# EAGLE design pcb (EAGLE 9.6.2)

## Sheet 1 of 4: Microcontrolador
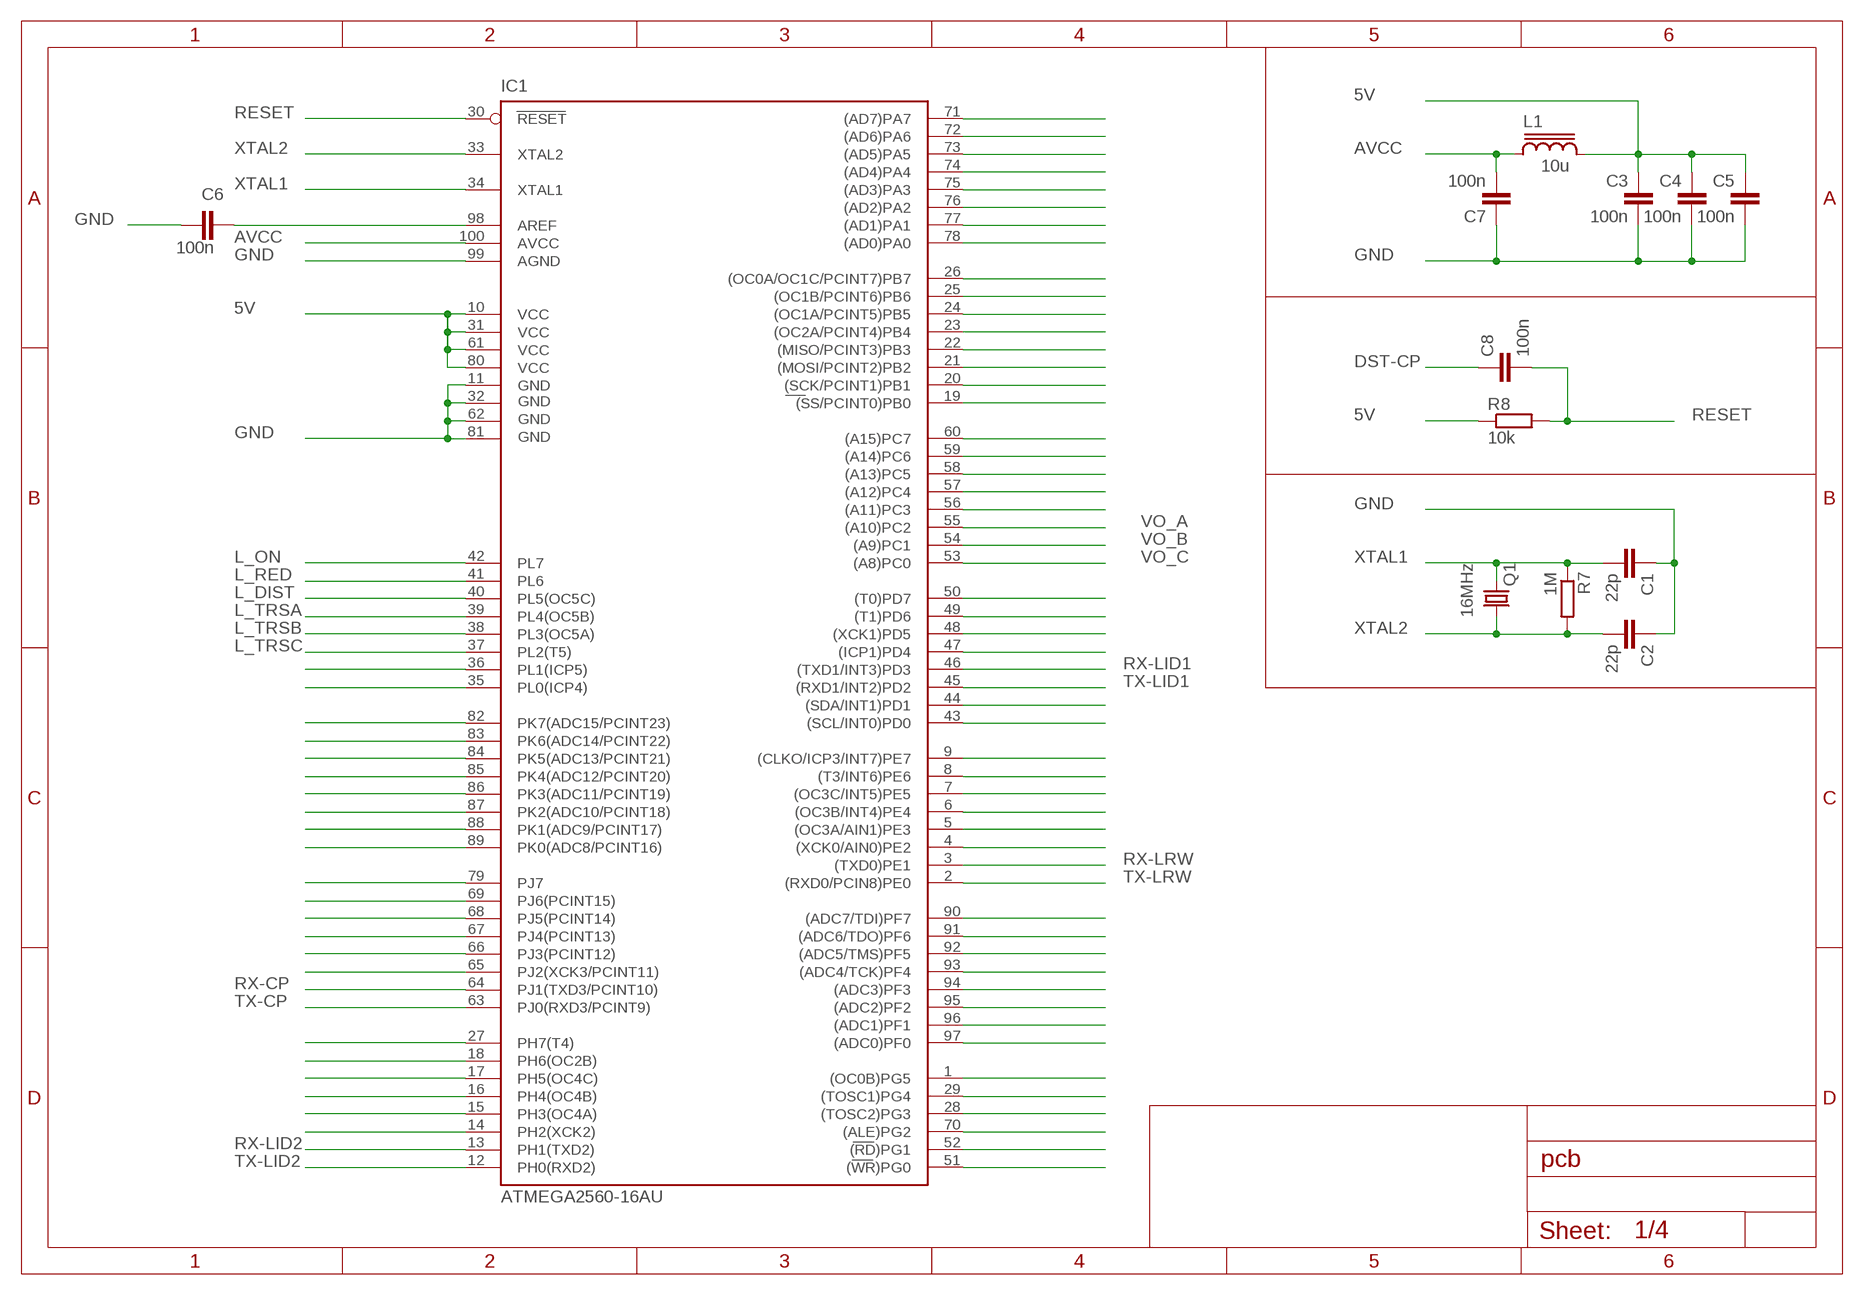
[diagram p0: schematic, sheet 1]

### Parts
C1  22p  C-EU050-025X075  [C050-025X075]
C2  22p  C-EU050-025X075  [C050-025X075]
C3  100n  C-EU050-025X075  [C050-025X075]
C4  100n  C-EU050-025X075  [C050-025X075]
C5  100n  C-EU050-025X075  [C050-025X075]
C6  100n  C-EU050-025X075  [C050-025X075]
C7  100n  C-EU050-025X075  [C050-025X075]
C8  100n  C-EU050-025X075  [C050-025X075]
IC1  ATMEGA2560-16AU  [TQFP100]
L1  10u  MSS1260  [MSS1260]
Q1  16MHz  CRYSTALHC18U-V  [HC18U-V]
R7  1M  R-EU_R1206W  [R1206W]
R8  10k  R-EU_R1206W  [R1206W]

### Nets
5V: C3.2 C4.2 C5.2 IC1.10(VCC) IC1.31(VCC1) IC1.61(VCC2) IC1.80(VCC3) L1.2 R8.1 ; also sheet 2,4
AVCC: C7.2 IC1.100(AVCC) L1.1
DST-CP: C8.1 ; also sheet 4
GND: C1.1 C2.1 C3.1 C4.1 C5.1 C6.2 C7.1 IC1.11(GND) IC1.32(GND1) IC1.62(GND2) IC1.81(GND3) IC1.99(AGND) ; also sheet 2,3,4
L_DIST: IC1.40(PL5(OC5C)) ; also sheet 4
L_ON: IC1.42(PL7)
L_RED: IC1.41(PL6) ; also sheet 4
L_TRSA: IC1.39(PL4(OC5B)) ; also sheet 4
L_TRSB: IC1.38(PL3(OC5A)) ; also sheet 4
L_TRSC: IC1.37(PL2(T5)) ; also sheet 4
N$22: C6.1 IC1.98(AREF)
N$46: IC1.36(PL1(ICP5))
N$47: IC1.82(PK7(ADC15/PCINT23))
N$48: IC1.84(PK5(ADC13/PCINT21))
N$49: IC1.86(PK3(ADC11/PCINT19))
N$50: IC1.88(PK1(ADC9/PCINT17))
N$52: IC1.79(PJ7)
N$53: IC1.68(PJ5(PCINT14))
N$54: IC1.66(PJ3(PCINT12))
N$56: IC1.27(PH7(T4))
N$57: IC1.17(PH5(OC4C))
N$58: IC1.15(PH3(OC4A))
N$60: IC1.71((AD7)PA7)
N$62: IC1.73((AD5)PA5)
N$63: IC1.75((AD3)PA3)
N$64: IC1.77((AD1)PA1)
N$66: IC1.26((OC0A/OC1C/PCINT7)PB7)
N$69: IC1.24((OC1A/PCINT5)PB5)
N$80: IC1.35(PL0(ICP4))
N$81: IC1.83(PK6(ADC14/PCINT22))
N$82: IC1.22((MISO/PCINT3)PB3)
N$83: IC1.19((SS/PCINT0)PB0)
N$84: IC1.60((A15)PC7)
N$85: IC1.58((A13)PC5)
N$86: IC1.56((A11)PC3)
N$87: IC1.85(PK4(ADC12/PCINT20))
N$88: IC1.87(PK2(ADC10/PCINT18))
N$89: IC1.89(PK0(ADC8/PCINT16))
N$90: IC1.69(PJ6(PCINT15))
N$91: IC1.67(PJ4(PCINT13))
N$92: IC1.65(PJ2(XCK3/PCINT11))
N$94: IC1.18(PH6(OC2B))
N$95: IC1.16(PH4(OC4B))
N$96: IC1.14(PH2(XCK2))
N$98: IC1.72((AD6)PA6)
N$99: IC1.74((AD4)PA4)
N$100: IC1.76((AD2)PA2)
N$101: IC1.78((AD0)PA0)
N$102: IC1.25((OC1B/PCINT6)PB6)
N$103: IC1.23((OC2A/PCINT4)PB4)
N$104: IC1.21((MOSI/PCINT2)PB2)
N$105: IC1.20((SCK/PCINT1)PB1)
N$106: IC1.59((A14)PC6)
N$107: IC1.57((A12)PC4)
N$110: IC1.49((T1)PD6)
N$111: IC1.47((ICP1)PD4)
N$113: IC1.43((SCL/INT0)PD0)
N$114: IC1.8((T3/INT6)PE6)
N$115: IC1.6((OC3B/INT4)PE4)
N$116: IC1.4((XCK0/AIN0)PE2)
N$118: IC1.91((ADC6/TDO)PF6)
N$119: IC1.93((ADC4/TCK)PF4)
N$120: IC1.95((ADC2)PF2)
N$121: IC1.97((ADC0)PF0)
N$122: IC1.29((TOSC1)PG4)
N$123: IC1.70((ALE)PG2)
N$124: IC1.51((WR)PG0)
N$126: IC1.50((T0)PD7)
N$127: IC1.48((XCK1)PD5)
N$129: IC1.44((SDA/INT1)PD1)
N$130: IC1.9((CLKO/ICP3/INT7)PE7)
N$131: IC1.7((OC3C/INT5)PE5)
N$132: IC1.5((OC3A/AIN1)PE3)
N$134: IC1.90((ADC7/TDI)PF7)
N$135: IC1.92((ADC5/TMS)PF5)
N$136: IC1.94((ADC3)PF3)
N$137: IC1.96((ADC1)PF1)
N$138: IC1.1((OC0B)PG5)
N$139: IC1.28((TOSC2)PG3)
N$140: IC1.52((RD)PG1)
RESET: C8.2 IC1.30(RESET) R8.2
RX-CP: IC1.64(PJ1(TXD3/PCINT10)) ; also sheet 4
RX-LID1: IC1.46((TXD1/INT3)PD3) ; also sheet 4
RX-LID2: IC1.13(PH1(TXD2)) ; also sheet 4
RX-LRW: IC1.3((TXD0)PE1) ; also sheet 3
TX-CP: IC1.63(PJ0(RXD3/PCINT9)) ; also sheet 4
TX-LID1: IC1.45((RXD1/INT2)PD2) ; also sheet 4
TX-LID2: IC1.12(PH0(RXD2)) ; also sheet 4
TX-LRW: IC1.2((RXD0/PCIN8)PE0) ; also sheet 3
VO_A: IC1.55((A10)PC2) ; also sheet 4
VO_B: IC1.54((A9)PC1) ; also sheet 4
VO_C: IC1.53((A8)PC0) ; also sheet 4
XTAL1: C1.2 IC1.34(XTAL1) Q1.1 R7.1
XTAL2: C2.2 IC1.33(XTAL2) Q1.2 R7.2

## Sheet 2 of 4: Alimentación y voltajes de la placa
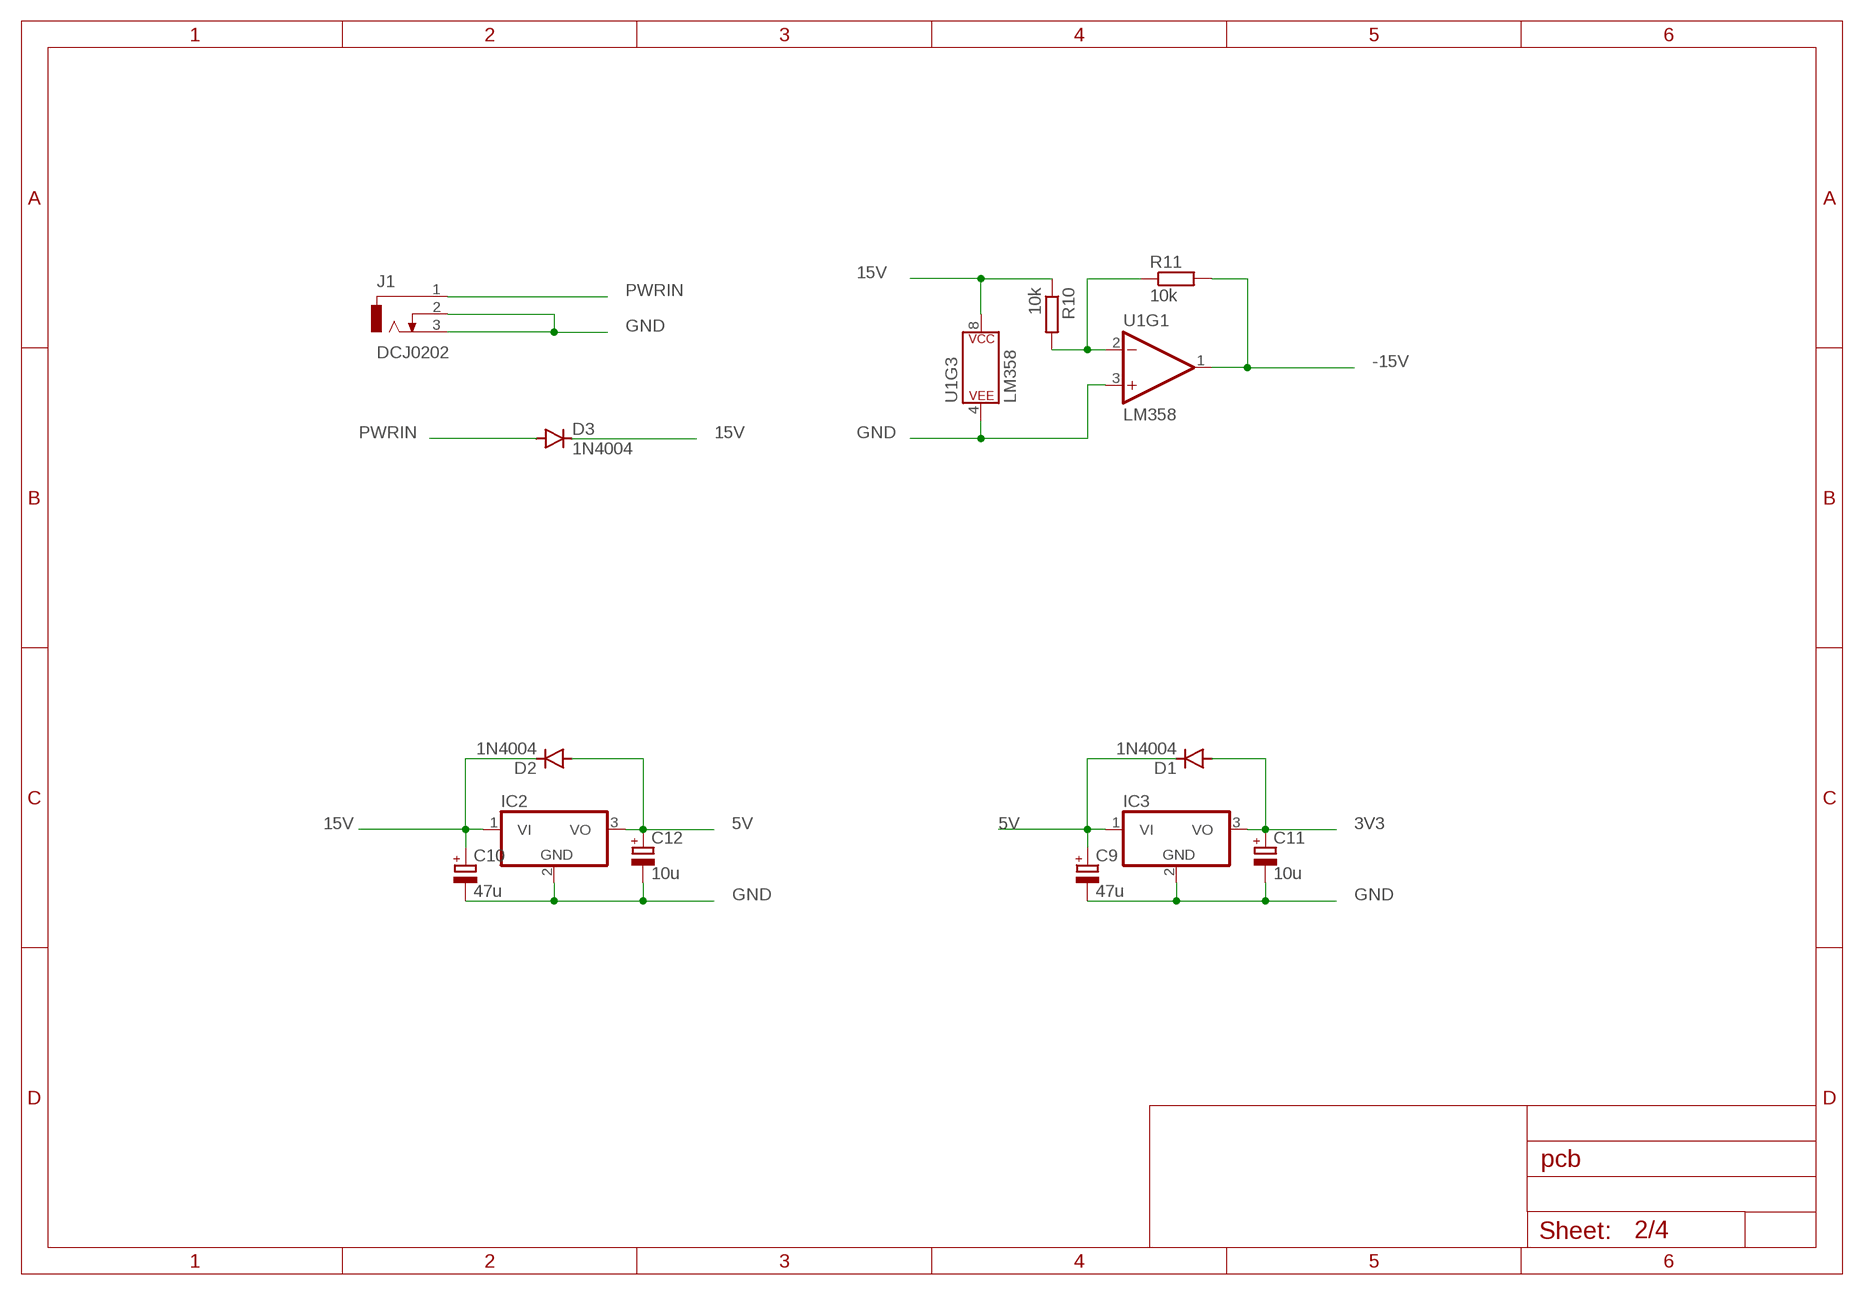
[diagram p1: schematic, sheet 2]

### Parts
C9  47u  CPOL-EUE2,5-6E  [E2,5-6E]
C10  47u  CPOL-EUE2,5-6E  [E2,5-6E]
C11  10u  CPOL-EUE2,5-6E  [E2,5-6E]
C12  10u  CPOL-EUE2,5-6E  [E2,5-6E]
D1  1N4004  [DO41-10]
D2  1N4004  [DO41-10]
D3  1N4004  [DO41-10]
IC2  7805T  [TO220H]
IC3  7805T  [TO220H]
J1  DCJ0202  [DCJ0202]
R10  10k  R-EU_R1206W  [R1206W]
R11  10k  R-EU_R1206W  [R1206W]
U1  LM358  [DIP08]

### Nets
3V3: C11.+ D1.A IC3.3(VO) ; also sheet 3,4
5V: C9.+ C12.+ D1.C D2.A IC2.3(VO) IC3.1(VI) ; also sheet 1,4
15V: C10.+ D2.C D3.C IC2.1(VI) R10.1 U1.8(P$V+) ; also sheet 4
-15V: R11.2 U1.1(OUT) ; also sheet 4
GND: C9.- C10.- C11.- C12.- IC2.2(GND) IC3.2(GND) J1.2 J1.3 U1.3(+IN) U1.4(P$V-) ; also sheet 1,3,4
N$15: R10.2 R11.1 U1.2(-IN)
PWRIN: D3.A J1.1
Unconnected: U1.5(+IN) U1.6(-IN) U1.7(OUT)

## Sheet 3 of 4: Modulo LoraWAN
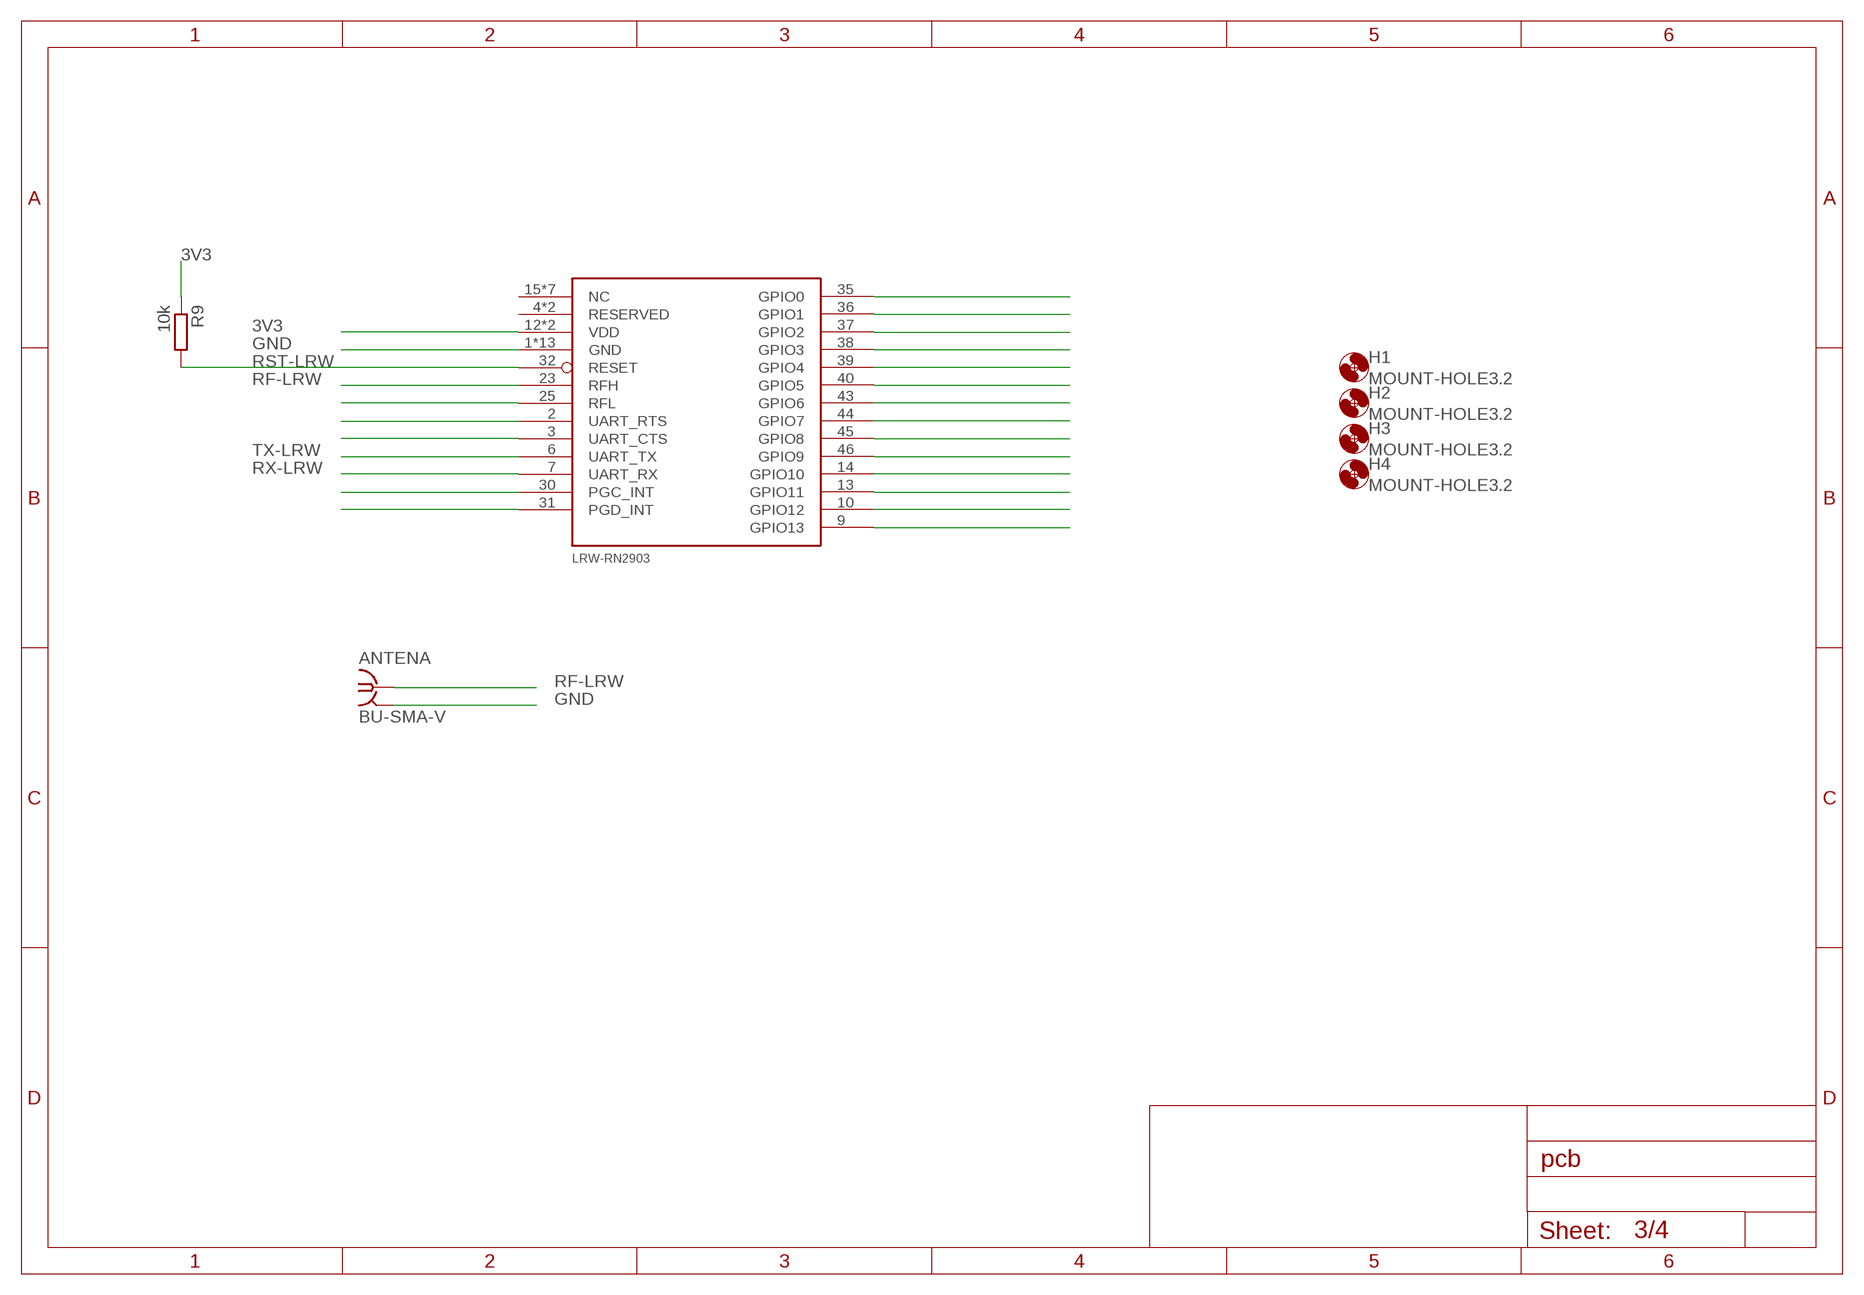
[diagram p2: schematic, sheet 3]

### Parts
ANTENA  BU-SMA-V  [BU-SMA-V]
H1  MOUNT-HOLE3.2  [3,2]
H2  MOUNT-HOLE3.2  [3,2]
H3  MOUNT-HOLE3.2  [3,2]
H4  MOUNT-HOLE3.2  [3,2]
LRW-RN2903  MICROCHIP_RN2483  [MICROCHIP_RN2483]
R9  10k  R-EU_R1206W  [R1206W]

### Nets
3V3: LRW-RN2903.12(VDD) LRW-RN2903.34(VDD) R9.1 ; also sheet 2,4
GND: ANTENA.2 ANTENA.3 ANTENA.4 ANTENA.5 LRW-RN2903.1(GND) LRW-RN2903.8(GND) LRW-RN2903.11(GND) LRW-RN2903.20(GND) LRW-RN2903.21(GND) LRW-RN2903.22(GND) LRW-RN2903.24(GND) LRW-RN2903.26(GND) LRW-RN2903.27(GND) LRW-RN2903.28(GND) LRW-RN2903.33(GND) LRW-RN2903.41(GND) LRW-RN2903.47(GND) ; also sheet 1,2,4
N$1: LRW-RN2903.35(GPIO0)
N$2: LRW-RN2903.36(GPIO1)
N$3: LRW-RN2903.37(GPIO2)
N$4: LRW-RN2903.38(GPIO3)
N$5: LRW-RN2903.40(GPIO5)
N$6: LRW-RN2903.44(GPIO7)
N$7: LRW-RN2903.14(GPIO10)
N$8: LRW-RN2903.13(GPIO11)
N$9: LRW-RN2903.9(GPIO13)
N$10: LRW-RN2903.39(GPIO4)
N$11: LRW-RN2903.43(GPIO6)
N$12: LRW-RN2903.45(GPIO8)
N$13: LRW-RN2903.46(GPIO9)
N$14: LRW-RN2903.10(GPIO12)
N$17: LRW-RN2903.25(RFL)
N$18: LRW-RN2903.3(UART_CTS)
N$20: LRW-RN2903.31(PGD_INT)
N$23: LRW-RN2903.2(UART_RTS)
N$25: LRW-RN2903.30(PGC_INT)
RF-LRW: ANTENA.1 LRW-RN2903.23(RFH)
RST-LRW: LRW-RN2903.32(RESET) R9.2
RX-LRW: LRW-RN2903.7(UART_RX) ; also sheet 1
TX-LRW: LRW-RN2903.6(UART_TX) ; also sheet 1
Unconnected: LRW-RN2903.4(RESERVED) LRW-RN2903.5(RESERVED) LRW-RN2903.15(NC) LRW-RN2903.16(NC) LRW-RN2903.17(NC) LRW-RN2903.18(NC) LRW-RN2903.19(NC) LRW-RN2903.29(NC) LRW-RN2903.42(NC)

## Sheet 4 of 4: Perifericos: sensores, leds y conversor
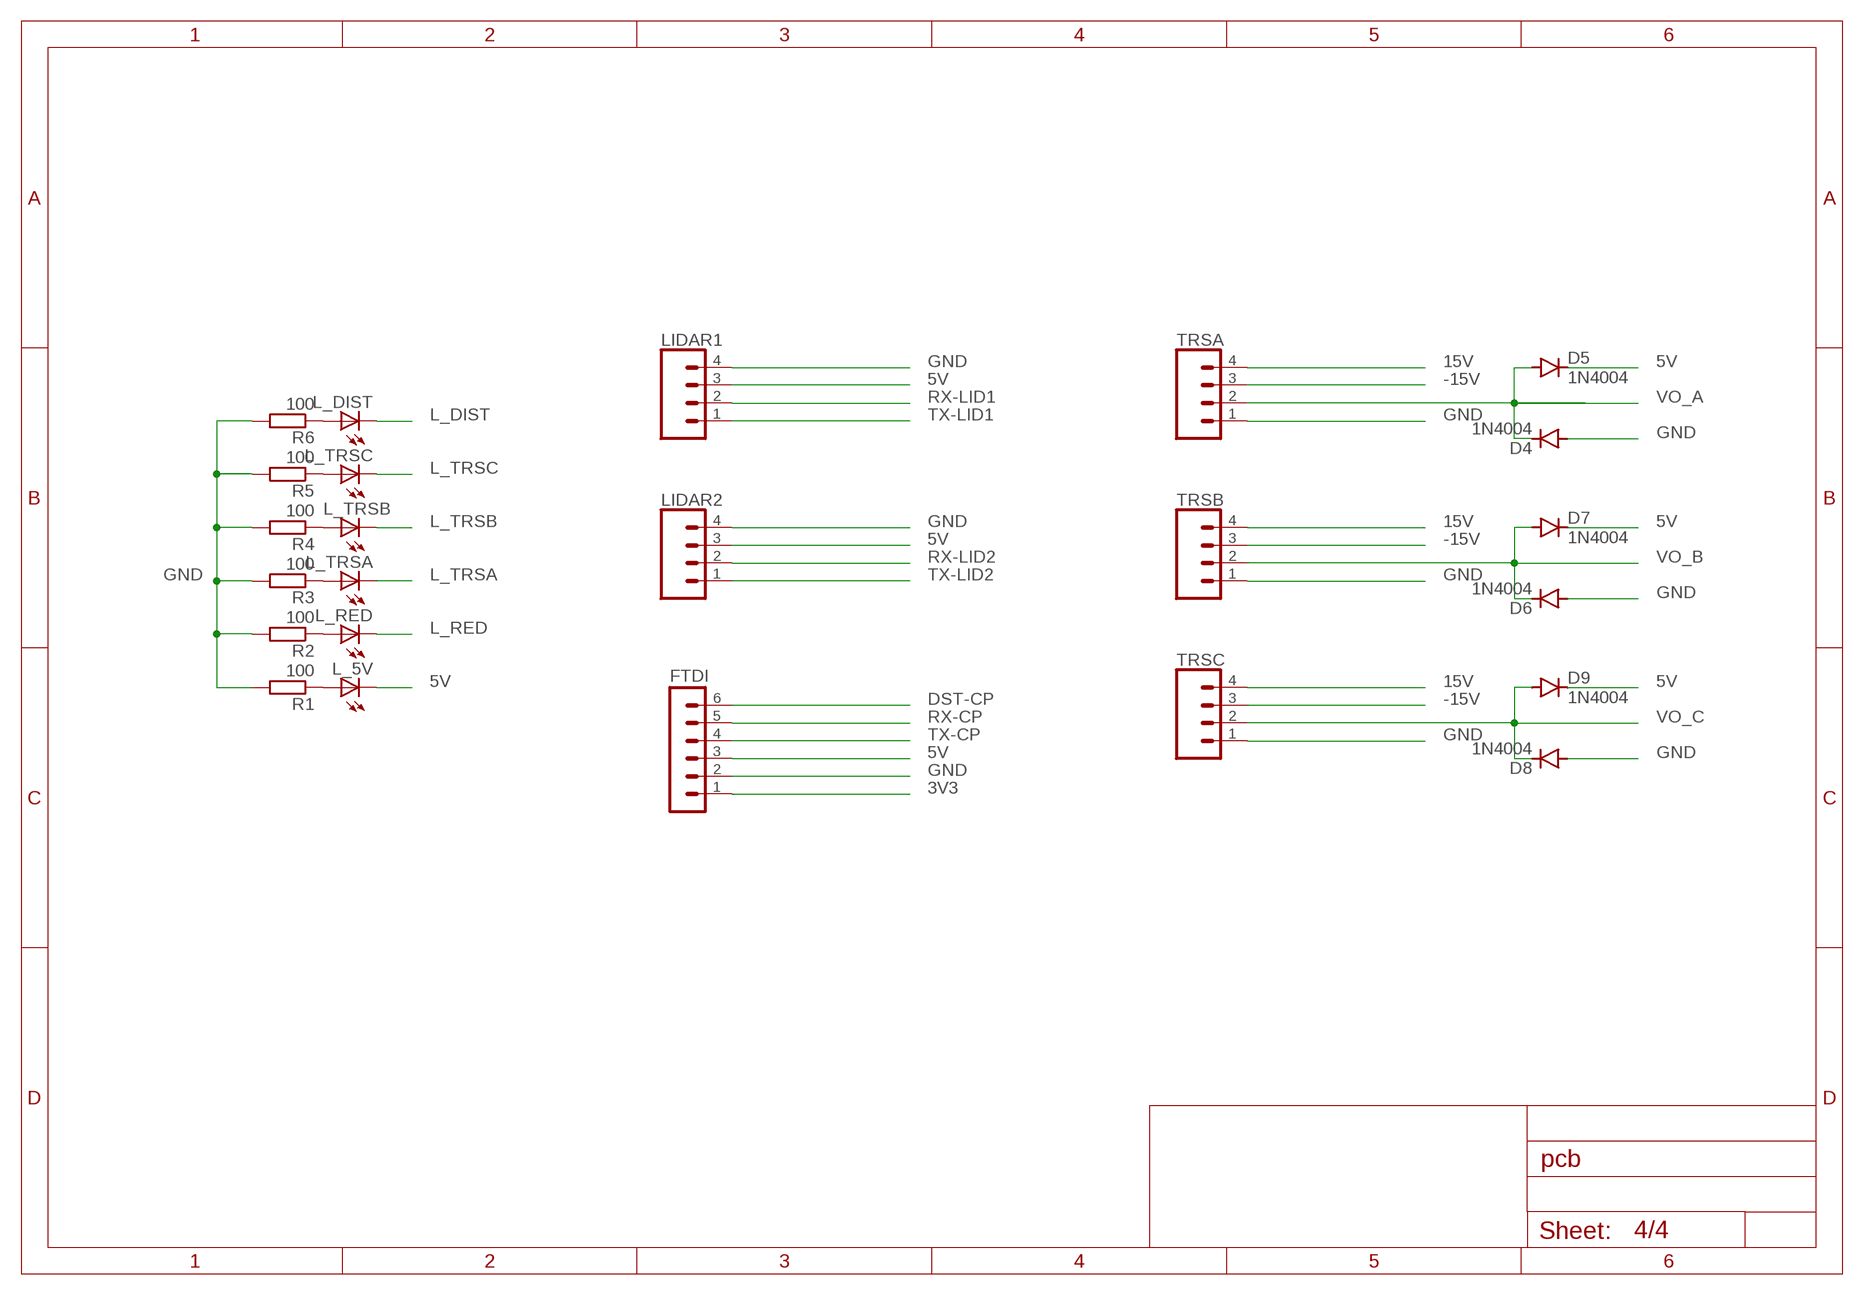
[diagram p3: schematic, sheet 4]

### Parts
D4  1N4004  [DO41-10]
D5  1N4004  [DO41-10]
D6  1N4004  [DO41-10]
D7  1N4004  [DO41-10]
D8  1N4004  [DO41-10]
D9  1N4004  [DO41-10]
FTDI  MA06-1  [MA06-1]
L_5V  LED5MM  [LED5MM]
L_DIST  LED5MM  [LED5MM]
L_RED  LED5MM  [LED5MM]
L_TRSA  LED5MM  [LED5MM]
L_TRSB  LED5MM  [LED5MM]
L_TRSC  LED5MM  [LED5MM]
LIDAR1  CONN_04JST-PTH  [JST-4-PTH]
LIDAR2  CONN_04JST-PTH  [JST-4-PTH]
R1  100  R-EU_R1206W  [R1206W]
R2  100  R-EU_R1206W  [R1206W]
R3  100  R-EU_R1206W  [R1206W]
R4  100  R-EU_R1206W  [R1206W]
R5  100  R-EU_R1206W  [R1206W]
R6  100  R-EU_R1206W  [R1206W]
TRSA  CONN_04JST-PTH  [JST-4-PTH]
TRSB  CONN_04JST-PTH  [JST-4-PTH]
TRSC  CONN_04JST-PTH  [JST-4-PTH]

### Nets
3V3: FTDI.1 ; also sheet 2,3
5V: D5.C D7.C D9.C FTDI.3 L_5V.K(C) LIDAR1.3 LIDAR2.3 ; also sheet 1,2
15V: TRSA.4 TRSB.4 TRSC.4 ; also sheet 2
-15V: TRSA.3 TRSB.3 TRSC.3 ; also sheet 2
DST-CP: FTDI.6 ; also sheet 1
GND: D4.A D6.A D8.A FTDI.2 LIDAR1.4 LIDAR2.4 R1.2 R2.2 R3.2 R4.2 R5.2 R6.2 TRSA.1 TRSB.1 TRSC.1 ; also sheet 1,2,3
L_DIST: L_DIST.K(C) ; also sheet 1
L_RED: L_RED.K(C) ; also sheet 1
L_TRSA: L_TRSA.K(C) ; also sheet 1
L_TRSB: L_TRSB.K(C) ; also sheet 1
L_TRSC: L_TRSC.K(C) ; also sheet 1
N$16: L_TRSB.A R4.1
N$32: L_5V.A R1.1
N$33: L_RED.A R2.1
N$34: L_TRSA.A R3.1
N$36: L_TRSC.A R5.1
N$37: L_DIST.A R6.1
RX-CP: FTDI.5 ; also sheet 1
RX-LID1: LIDAR1.2 ; also sheet 1
RX-LID2: LIDAR2.2 ; also sheet 1
TX-CP: FTDI.4 ; also sheet 1
TX-LID1: LIDAR1.1 ; also sheet 1
TX-LID2: LIDAR2.1 ; also sheet 1
VO_A: D4.C D5.A TRSA.2 ; also sheet 1
VO_B: D6.C D7.A TRSB.2 ; also sheet 1
VO_C: D8.C D9.A TRSC.2 ; also sheet 1

## Library data of the parts
ANTENA = con-coax:BU-SMA-V: FEMALE SMA CONNECTOR Radiall distributor RS 112-3794; OC_FARNELL: unknown; OC_NEWARK: unknown
C1-C8 = rcl:C-EU: CAPACITOR, European symbol; SPICEPREFIX: C
C9-C12 = rcl:CPOL-EU: POLARIZED CAPACITOR, European symbol; SPICEPREFIX: C
D1-D9 = diode:1N4004: DIODE general purpose rectifier, 1 A
FTDI = con-lstb:MA06-1: PIN HEADER; OC_FARNELL: unknown; OC_NEWARK: unknown
H1-H4 = holes:MOUNT-HOLE: MOUNTING HOLE with drill center marker
IC1 = atmel-2005:ATMEGA*: MICROCONTROLLER 64/128/256 Kbytes FLASH 4 Kbytes EEPROM 8 Kbytes SRAM 86 General Purpose I/O pins 12-channels16-bit PWM 4 x Serial USARTs 16-channels 10-bit A/D
IC2 = linear:78*: Positive VOLTAGE REGULATOR Source: http://cache.national.com/ds/LM/LM78L05.pdf http://www.fairchildsemi.com/ds/LM/LM7805.pdf; VOUT: 5V
IC3 = linear:78*: Positive VOLTAGE REGULATOR Source: http://cache.national.com/ds/LM/LM78L05.pdf http://www.fairchildsemi.com/ds/LM/LM7805.pdf
J1 = con-jack:DCJ0202: DC POWER JACK Source: DCJ0202.pdf; OC_FARNELL: unknown; OC_NEWARK: unknown
L1 = inductor-coilcraft2:MSS1260: SMT Power Inductor
L_5V L_DIST L_RED L_TRSA L_TRSB L_TRSC = adafruit:LED: LED OSRAM: - CHIPLED LG R971, LG N971, LY N971, LG Q971, LY Q971, LO R971, LY R971 LH N974, LH R974 LS Q976, LO Q976, LY Q976 LO Q996 - Hyper CHIPLED LW Q18S LB Q993, LB Q99A, LB R99A - SideLED LS A670, LO A670, LY A670, LG A670, LP A670 LB A673, LV A673, LT A673, LW A673 LH A674 LY A675 LS A676, LA A676, LO A676, LY A676, LW A676 LS A679, LY A679, LG A679 - Hyper Micro SIDELED® LS Y876, LA Y876, LO Y876, LY Y876 LT Y87S - SmartLED LW L88C, LW L88S LB L89C, LB L89S, LG L890 LS L89K, LO L89K, LY L89K LS L896, LA L896, LO L896, LY L896 - TOPLED LS T670, LO T670, LY T670, LG T670, LP T670 LSG T670, LSP T670, LSY T670, LOP T670, LYG T670 LG T671, LOG T671, LSG T671 LB T673, LV T673, LT T673, LW T673 LH T674 LS T676, LA T676, LO T676, LY T676, LB T676, LH T676, LSB T676, LW T676 LB T67C, LV T67C, LT T67C, LS T67K, LO T67K, LY T67K, LW E67C LS E67B, LA E67B, LO E67B, LY E67B, LB E67C, LV E67C, LT E67C LW T67C LS T679, LY T679, LG T679 LS T770, LO T770, LY T770, LG T770, LP T770 LB T773, LV T773, LT T773, LW T773 LH T774 LS E675, LA E675, LY E675, LS T675 LS T776, LA T776, LO T776, LY T776, LB T776 LHGB T686 LT T68C, LB T68C - Hyper Mini TOPLED® LB M676 - Mini TOPLED Santana® LG M470 LS M47K, LO M47K, LY M47K Source: http://www.osram.convergy.de/
LIDAR1 LIDAR2 TRSA TRSB TRSC = sparkfun-connectors:CONN_04: Multi connection point. Often used as Generic Header-pin footprint for 0.1 inch spaced/style header connections On any of the 0.1 inch spaced packages, you can populate with these: Break Away Headers - Straight <https://www.sparkfun.com/products/116> (PRT-00116) Break Away Male Headers - Right Angle <https://www.sparkfun.com/products/553> (PRT-00553) Female Headers <https://www.sparkfun.com/products/115> (PRT-00115) Break Away Headers - Machine Pin <https://www.sparkfun.com/products/117> (PRT-00117) Break Away Female Headers - Swiss Machine Pin <https://www.sparkfun.com/products/743> (PRT-00743) For SCREWTERMINALS and SPRING TERMINALS visit here: Screw Terimnals on SparkFun.com <https://www.sparkfun.com/search/results?term=Screw+Terminals> (5mm/3.5mm/2.54mm spacing) This device is also useful as a general connection point to wire up your design to another part of your project. Our various solder wires solder well into these plated through hole pads. Hook-Up Wire - Assortment (Stranded, 22 AWG) <https://www.sparkfun.com/products/11375> (PRT-11375) Hook-Up Wire - Assortment (Solid Core, 22 AWG) <https://www.sparkfun.com/products/11367> (PRT-11367) View the entire wire category on our website here <https://www.sparkfun.com/categories/141> Special notes: Molex polarized connector foot print use with SKU : PRT-08231 with associated crimp pins and housings. 1MM SMD Version SKU: PRT-10208; PROD_ID: WIRE-13531; SF_ID: PRT-09916
LRW-RN2903 = lora-lorawan-modules:MICROCHIP_RN2483: Microchip LoRaWAN module RN2483 <https://www.microchip.com/wwwproducts/en/RN2483> is the 868 MHz one and RN2903 <https://www.microchip.com/wwwproducts/en/RN2903> is the 915 MHz one; HEIGHT: 3; LENGT: 26.7; WIDTH: 17.8
Q1 = crystal:CRYSTAL: CRYSTAL; OC_FARNELL: unknown; OC_NEWARK: unknown
R1-R11 = rcl:R-EU_: RESISTOR, European symbol; SPICEPREFIX: R
U1 = sparkfun-amplifiers:LM358: LM358 Jellybean op-amp Datasheet <http://www.sparkfun.com/datasheets/Components/General/LM358.pdf> SparkFun Products Op-Amp (Thru-Hole) - LM358 <https://www.sparkfun.com/products/9456> (COM-09456); PROD_ID: IC-09172

## Board
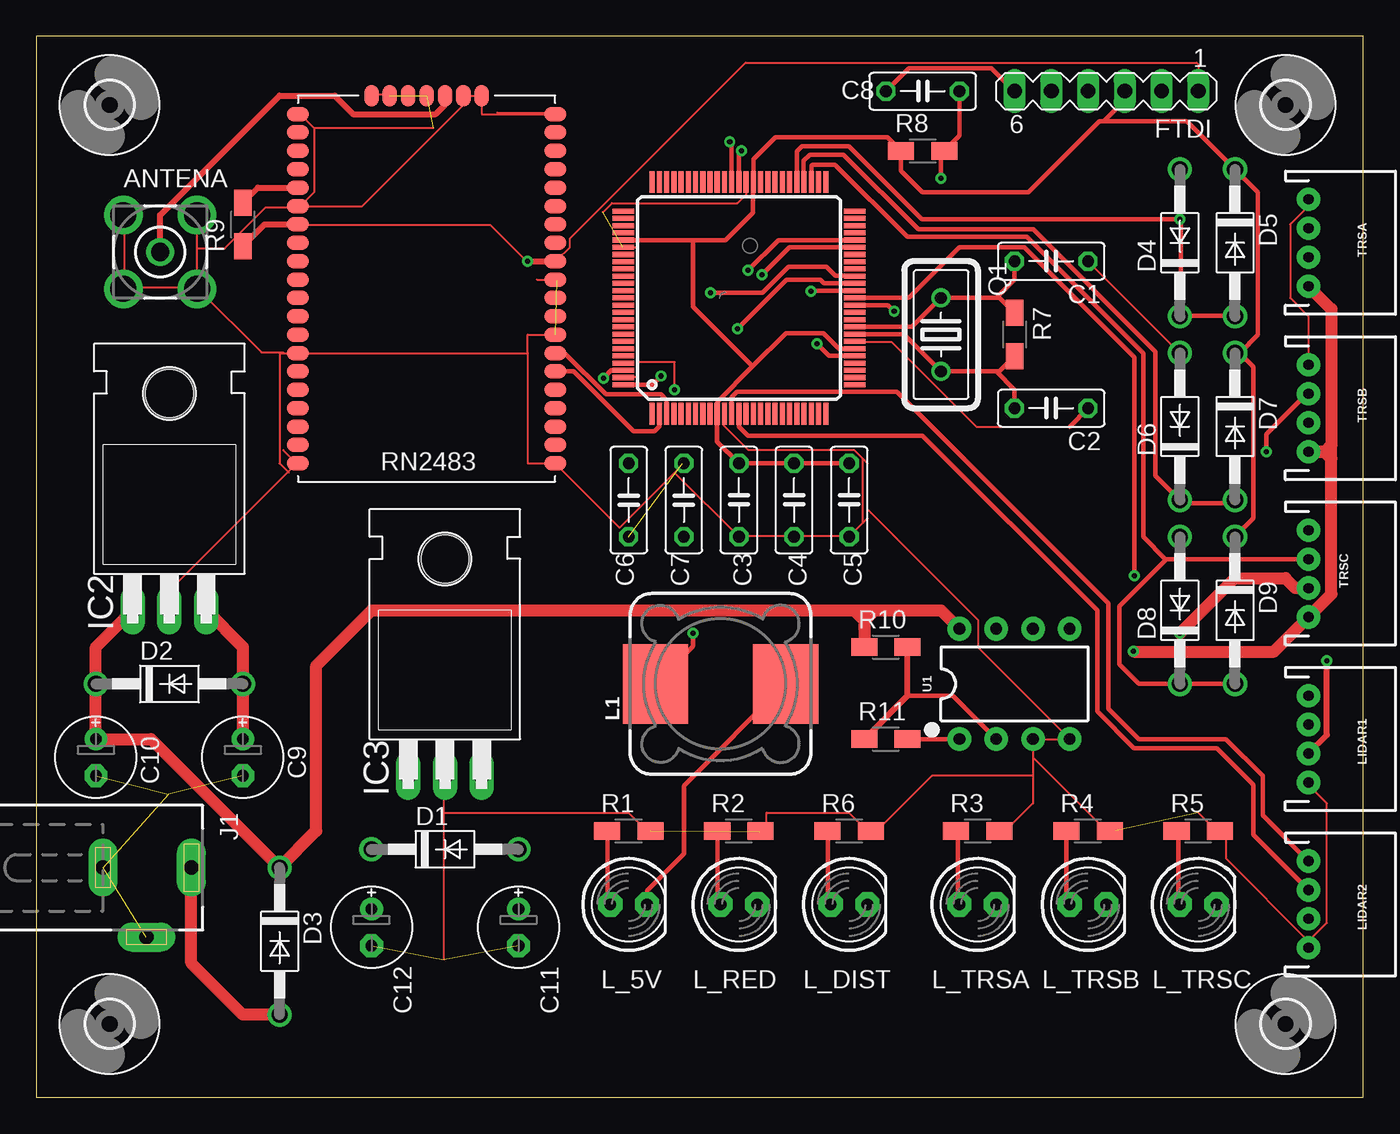
[diagram p4: board, top side]
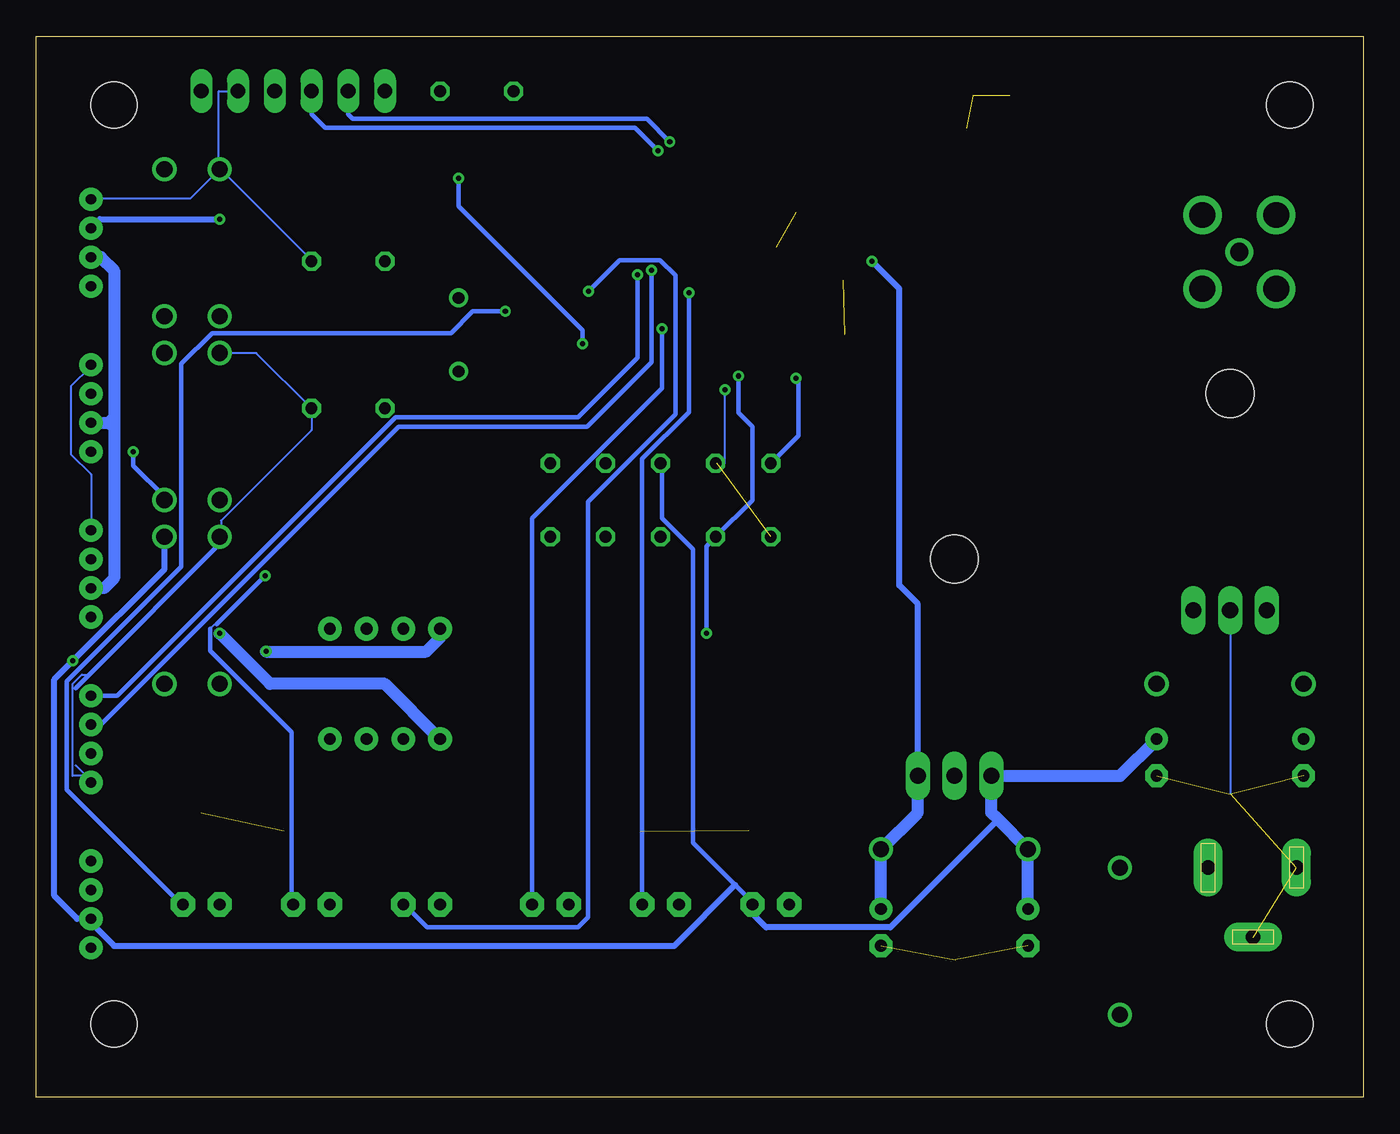
[diagram p5: board, bottom side, seen from below]

Size 91.74 x 73.33 mm. Coordinates in mm from the lower left corner, seen from the top.
Outline: 0,0 91.74,0 91.74,73.33 0,73.33 0,0
Copper layers (1*16): Top 0.035mm / dielectric 1.5mm / Bottom 0.035mm
Design rules "default": minimum track width 6mil, minimum drill 0.35mm, track to track 6mil, track to pad 6mil, pad to pad 6mil, via to via 6mil, smd to smd 6mil, copper to edge 40mil, drill to drill 6mil, minimum pad ring 10mil, minimum via ring 8mil, stop-mask expansion 4mil, vias tented up to drill 0mil, thermal gap 10mil

### Footprints (pad centres in the part's own frame; a part is rotated, then mirrored left to right if it is on the bottom)
BU-SMA-V = drill 1.27: 1 0,0 | drill 1.778: 2 -2.55,2.55; 3 2.55,2.55; 4 2.55,-2.55; 5 -2.55,-2.55
C050-025X075 = drill 0.813 octagon: 1 -2.54,0; 2 2.54,0
E2,5-6E = drill 0.813 pad 1.575: + -1.27,0 | drill 0.813 pad 1.575 octagon: - 1.27,0
DO41-10 = drill 1.118: A 5.08,0; C -5.08,0
MA06-1 = drill 1.016 long: 1 -6.35,0; 2 -3.81,0; 3 -1.27,0; 4 1.27,0; 5 3.81,0; 6 6.35,0
3,2 = hole 3.2: 0,0
TQFP100 = smd 1.5 x 0.35: 1 -8,6; 2 -8,5.5; 3 -8,5; 4 -8,4.5; 5 -8,4; 6 -8,3.5; 7 -8,3; 8 -8,2.5; 9 -8,2; 10 -8,1.5; 11 -8,1; 12 -8,0.5; 13 -8,0; 14 -8,-0.5; 15 -8,-1; 16 -8,-1.5; 17 -8,-2; 18 -8,-2.5; 19 -8,-3; 20 -8,-3.5; 21 -8,-4; 22 -8,-4.5; 23 -8,-5; 24 -8,-5.5; 25 -8,-6; 51 8,-6; 52 8,-5.5; 53 8,-5; 54 8,-4.5; 55 8,-4; 56 8,-3.5; 57 8,-3; 58 8,-2.5; 59 8,-2; 60 8,-1.5; 61 8,-1; 62 8,-0.5; 63 8,0; 64 8,0.5; 65 8,1; 66 8,1.5; 67 8,2; 68 8,2.5; 69 8,3; 70 8,3.5; 71 8,4; 72 8,4.5; 73 8,5; 74 8,5.5; 75 8,6 | smd 0.35 x 1.5: 26 -6,-8; 27 -5.5,-8; 28 -5,-8; 29 -4.5,-8; 30 -4,-8; 31 -3.5,-8; 32 -3,-8; 33 -2.5,-8; 34 -2,-8; 35 -1.5,-8; 36 -1,-8; 37 -0.5,-8; 38 0,-8; 39 0.5,-8; 40 1,-8; 41 1.5,-8; 42 2,-8; 43 2.5,-8; 44 3,-8; 45 3.5,-8; 46 4,-8; 47 4.5,-8; 48 5,-8; 49 5.5,-8; 50 6,-8; 76 6,8; 77 5.5,8; 78 5,8; 79 4.5,8; 80 4,8; 81 3.5,8; 82 3,8; 83 2.5,8; 84 2,8; 85 1.5,8; 86 1,8; 87 0.5,8; 88 0,8; 89 -0.5,8; 90 -1,8; 91 -1.5,8; 92 -2,8; 93 -2.5,8; 94 -3,8; 95 -3.5,8; 96 -4,8; 97 -4.5,8; 98 -5,8; 99 -5.5,8; 100 -6,8
TO220H = drill 1.118 long: 1 -2.54,-10.16; 2 0,-10.16; 3 2.54,-10.16 | hole 3.302: 0,4.826
DCJ0202 = drill 1 pad 2 long: 1 0,3.1; 2 4.8,0; 3 0,-3
MSS1260 = smd 5.5 x 4.5: 1 0,4.5; 2 0,-4.5
LED5MM = drill 0.813 pad 1.676 octagon: A -1.27,0; K 1.27,0
JST-4-PTH = drill 0.7 pad 1.6: 1 -3,0; 2 -1,0; 3 1,0; 4 3,0
MICROCHIP_RN2483 = smd 1.524 x 1.016: 1 17.78,1.27; 2 17.78,2.54; 3 17.78,3.81; 4 17.78,5.08; 5 17.78,6.35; 6 17.78,7.62; 7 17.78,8.89; 8 17.78,10.16; 9 17.78,11.43; 10 17.78,12.7; 11 17.78,13.97; 12 17.78,15.24; 13 17.78,16.51; 14 17.78,17.78; 15 17.78,19.05; 16 17.78,20.32; 17 17.78,21.59; 18 17.78,22.86; 19 17.78,24.13; 20 17.78,25.4; 28 0,25.4; 29 0,24.13; 30 0,22.86; 31 0,21.59; 32 0,20.32; 33 0,19.05; 34 0,17.78; 35 0,16.51; 36 0,15.24; 37 0,13.97; 38 0,12.7; 39 0,11.43; 40 0,10.16; 41 0,8.89; 42 0,7.62; 43 0,6.35; 44 0,5.08; 45 0,3.81; 46 0,2.54; 47 0,1.27 | smd 1.016 x 1.524: 21 12.7,26.67; 22 11.43,26.67; 23 10.16,26.67; 24 8.89,26.67; 25 7.62,26.67; 26 6.35,26.67; 27 5.08,26.67
HC18U-V = drill 0.813: 1 -2.54,0; 2 2.54,0
R1206W = smd 1.8 x 1.2: 1 -1.499,0; 2 1.499,0
DIP08 = drill 0.813 pad 1.626: 1 -3.81,-3.81; 2 -1.27,-3.81; 3 1.27,-3.81; 4 3.81,-3.81; 5 3.81,3.81; 6 1.27,3.81; 7 -1.27,3.81; 8 -3.81,3.81

### Placement (x,y rotation side)
ANTENA  8.57,58.42 0 top
C1  70.17,57.78 180 top
C2  70.17,47.62 180 top
C3  48.58,41.27 90 top
C4  52.39,41.27 90 top
C5  56.2,41.27 90 top
C6  40.96,41.27 270 top
C7  44.77,41.27 270 top
C8  61.28,69.53 0 top
C9  14.29,23.5 270 top
C10  4.13,23.5 270 top
C11  33.34,11.75 270 top
C12  23.18,11.75 270 top
D1  28.26,17.14 0 top
D2  9.21,28.57 0 top
D3  16.83,10.79 270 top
D4  79.06,59.05 90 top
D5  82.87,59.05 270 top
D6  79.06,46.35 90 top
D7  82.87,46.35 270 top
D8  79.06,33.66 90 top
D9  82.87,33.66 270 top
FTDI  73.98,69.53 180 top
H1  5.08,5.08 0 top
H2  5.08,68.58 0 top
H3  86.36,68.58 0 top
H4  86.36,5.08 0 top
IC1  48.58,55.24 90 top
IC2  9.21,43.81 0 top
IC3  28.26,32.38 0 top
J1  7.62,15.88 270 top
L1  47.31,28.57 90 top
L_5V  40.96,13.34 0 top
L_DIST  56.2,13.34 0 top
L_RED  48.58,13.34 0 top
L_TRSA  65.09,13.34 0 top
L_TRSB  72.71,13.34 0 top
L_TRSC  80.33,13.34 0 top
LIDAR1  87.95,24.77 270 top
LIDAR2  87.95,13.34 270 top
LRW-RN2903  18.1,42.55 0 top
Q1  62.55,52.7 270 top
R1  40.96,18.41 0 top
R2  48.58,18.41 0 top
R3  65.09,18.41 0 top
R4  72.71,18.41 0 top
R5  80.33,18.41 0 top
R6  56.2,18.41 0 top
R7  67.63,52.7 270 top
R8  61.28,65.41 0 top
R9  14.29,60.33 90 top
R10  58.74,31.11 0 top
R11  58.74,24.77 0 top
TRSA  87.95,59.05 270 top
TRSB  87.95,47.62 270 top
TRSC  87.95,36.2 270 top
U1  67.63,28.57 0 top

### Tracks (layer width: path | path; a pad name or v marks a point on that pad's centre or on a via)
3V3  (via drill 0.35)
  Top 0.152: FTDI.1 80.33,71.4 80.23,71.5 49.03,71.5 36.89,59.36 36.89,58.75 35.98,57.84 LRW-RN2903.12 | LRW-RN2903.34 18.15,60.27 31.41,60.27 33.85,57.84 v33.97,57.78
  Top 0.406: R9.1 15.79,60.33 LRW-RN2903.34 | v33.97,57.78 LRW-RN2903.12
  Bottom 0.406: IC3.3 30.8,34.1 32.08,35.39 32.08,55.89 v33.97,57.78
  Bottom 0.813: IC3.3 30.8,19.68 D1.A C11.+
5V  (via drill 0.35)
  Top 0.152: 49.54,63.17 IC1.61 | 47.1,48.08 47.1,47.32 IC1.10 | 56.55,51.74 IC1.31
  Top 0.305: IC1.61 49.58,64.82 51.12,66.36 58.83,66.36 R8.1 59.78,64.05 61.28,62.55 68.58,62.55 73.5,67.47 73.82,67.47 | FTDI.3 75.25,68.9 73.82,67.47 | 73.82,67.47 79.53,67.47 D5.C 84.45,62.55 84.45,52.7 83.19,51.44 | 83.19,51.44 D7.C | D9.C 84.14,40.01 84.14,50.48 83.19,51.44 | C5.2 C4.2 C3.2 47.08,45.31 IC1.10 | L_5V.K 42.23,14.29 44.77,16.83 44.77,21.54 L1.2 | 49.54,63.17 49.54,61.14 47.65,59.24 IC1.80 | 56.55,51.74 55.49,51.74 54.42,52.81 51.83,52.81 49.53,50.51 | 47.1,48.08 49.53,50.51 | 45.39,59.21 45.39,54.65 49.53,50.51
  Top 0.406: LIDAR1.3 89.22,25.04 v89.22,30.16
  Top 0.813: IC2.3 14.29,31.11 D2.A C9.+
  Bottom 0.152: 48.48,43.81 C3.2
  Bottom 0.305: 48.48,43.81 48.48,40.01 46.34,37.87 46.34,17.6 43.42,14.68 42.23,13.49 L_5V.K
  Bottom 0.406: 25.24,19.21 32.7,11.75 41.27,11.75 42.23,12.7 L_5V.K | D9.C 82.87,36.51 v89.22,30.16 90.49,28.89 90.49,13.92 88.9,12.34 LIDAR2.3 87.95,12.06 86.36,10.48 47.62,10.48 43.42,14.68
  Bottom 0.813: C9.+ 16.83,22.23 IC3.1 25.72,19.68 25.24,19.21 D1.C C12.+
15V  (via drill 0.35)
  Top 0.152: 57.24,32.38 57.47,32.38 57.47,33.02 57.24,32.93
  Top 0.813: IC2.1 4.13,31.11 D2.C C10.+ 7.94,24.77 D3.C 19.37,18.41 19.37,29.84 23.18,33.66 56.52,33.66 | 56.52,33.66 57.24,32.93 57.96,33.66 | 57.24,32.61 57.24,32.38 R10.1 | 56.52,33.66 57.96,33.66 | 57.96,33.66 62.55,33.66 U1.8 | TRSA.4 89.53,54.47 89.53,45.09 | 89.53,45.09 89.08,44.62 TRSB.4 89.04,44.62 89.53,44.13 | 89.53,44.13 89.53,34.78 TRSC.4 85.55,30.8 75.88,30.8 v75.86,30.82 | 89.53,44.13 89.53,45.09
  Bottom 0.813: v75.86,30.82 75.83,30.8 64.77,30.8 63.82,31.75 U1.8
-15V  (via drill 0.35)
  Top 0.152: 60.36,24.77 R11.2 | 63.72,24.77 U1.1
  Top 0.305: 63.72,24.77 60.36,24.77
  Top 0.813: v79.06,32.07 82.87,35.88 86.36,35.88 87.04,35.2 TRSC.3
  Bottom 0.813: U1.1 67.63,28.57 75.56,28.57 v79.06,32.07 | TRSA.3 87.27,58.05 86.36,57.15 86.36,46.99 | TRSB.3 86.72,46.62 | 86.36,46.99 86.72,46.62 | 86.72,46.62 86.36,46.26 | 86.36,46.26 86.36,35.88 87.04,35.2 TRSC.3 | 86.36,46.99 86.36,46.26
AVCC  (via drill 0.35)
  Top 0.305: L1.1 45.4,31.17 v45.4,32.07 | v43.18,49.85 42.58,49.24 IC1.100
  Bottom 0.305: v45.4,32.07 45.4,38.1 C7.2 42.23,41.27 42.23,46.35 43.18,47.31 v43.18,49.85
DST-CP
  Top 0.305: C8.1 60.33,71.12 66.04,71.12 FTDI.6
GND  (via drill 0.35)  (13 unrouted)
  Top 0.152: 35.98,56.46 LRW-RN2903.11 34.61,56.52 | 41.62,50.8 41.62,58.6 41.47,58.75 40.7,58.75 IC1.81 40.55,58.75 | 41.62,50.8 41.62,49.91 41.47,49.76 40.7,49.76 IC1.99 | 39.17,61.18 39.79,61.8 48.48,61.8 49.09,62.41 49.09,63.17 IC1.62 | 35.98,43.81 LRW-RN2903.1 | 44.67,43.81 C7.1 44.13,43.18 | C3.1 48.63,38.79 52.29,38.79 C4.1 52.44,38.79 56.1,38.79 C5.1 57.47,40.01 57.47,40.64 | 57.16,44.12 56.55,44.73 49.24,44.73 47.56,46.41 47.56,47.17 IC1.11 | 57.16,39.7 57.16,44.12 | 48.48,38.79 C3.1 | 35.83,43.81 LRW-RN2903.1 | 19.21,66.98 19.21,62.56 18.3,61.65 18.15,61.65 LRW-RN2903.33 | 19.21,66.98 18.15,68.05 LRW-RN2903.28 | LRW-RN2903.27 23.18,69.27 24.4,69.27 LRW-RN2903.26 | 30.8,69.27 LRW-RN2903.21 | 31.86,68.05 35.83,68.05 LRW-RN2903.20 30.8,67.94 LRW-RN2903.21 | 30.8,69.11 LRW-RN2903.21 | 26.99,69.27 LRW-RN2903.24 26.99,69.85 | 29.58,69.27 LRW-RN2903.22 | 27.45,66.98 19.21,66.98 | 29.58,69.11 LRW-RN2903.22 | 6.08,55.93 6.08,60.96 ANTENA.2 | 17.08,44.73 18,43.81 | 18,51.44 LRW-RN2903.41 | 16.83,51.47 15.57,51.47 11.27,55.78 ANTENA.4 11.11,55.93 | 16.83,51.47 17.08,51.47 | 11.11,55.93 11.11,58.67 | 11.11,58.67 ANTENA.3 | 11.11,55.93 6.08,55.93 | 6.08,55.93 ANTENA.5 | 11.11,58.67 13.04,58.67 15.86,61.49 18,61.49 LRW-RN2903.33 | 18,43.81 17.41,43.23 | 17.41,43.23 9.31,35.13 9.31,33.76 IC2.2 | 18,43.81 LRW-RN2903.47 | LRW-RN2903.41 33.97,51.44 | IC1.32 56.71,52.2 59.14,52.2 64.99,46.35 71.44,46.35 | TRSB.1 87.95,53.98 86.68,55.24 86.68,60.33 87.95,61.59 TRSA.1 87.95,61.95 | 78.96,51.44 D6.A C1.1 72.71,57.68 | 42.38,18.36 R1.2 42.23,18.41 40.96,19.68 28.21,19.68 | 28.21,9.53 28.21,19.68 | 28.21,19.68 28.21,22.17 IC3.2
  Top 0.152: 50.15,18.52 R2.2 | 57.62,18.52 R6.2 | 66.61,18.36 R3.2 | 74.08,18.36 R4.2 | 81.7,18.52 R5.2 | 74.23,18.52 R4.2 | 87.95,10.74 LIDAR2.4 | 81.85,18.36 R5.2 | 87.95,10.44 LIDAR2.4 | 71.34,24.77 U1.4 | 57.77,18.52 R6.2 | 66.46,18.52 R3.2 | 50,18.36 R2.2 | R6.2 57.47,18.41 56.2,19.68 50.48,19.68 50.48,18.41 R2.2 | 68.9,23.5 U1.3 U1.4 | 68.9,23.5 68.9,22.23 | 68.9,22.23 68.9,20.32 66.99,18.41 R3.2 | 68.9,23.5 73.98,18.41 R4.2 | 80.33,19.68 81.6,18.41 R5.2 | 74.61,18.41 R4.2 | 68.9,22.23 61.91,22.23 58.1,18.41 R6.2 | 87.95,10.79 82.23,16.51 82.23,18.41 R5.2 | 87.95,10.79 89.22,12.06 89.22,20.32 87.95,21.59 LIDAR1.4 | 87.95,10.79 LIDAR2.4 | LRW-RN2903.1 40.32,39.37 44.13,43.18 | 41.62,50.8 44.13,50.8 v44.13,48.9 | 44.13,43.18 C3.1 | 57.16,44.12 57.47,43.81 57.47,40.64 | LRW-RN2903.22 LRW-RN2903.21 | LRW-RN2903.8 33.97,52.7 33.97,51.44 | 16.83,51.44 LRW-RN2903.41 | LRW-RN2903.22 29.53,68.58 22.54,61.59 LRW-RN2903.33 | LRW-RN2903.1 33.97,43.81 33.97,51.44 | 17.41,43.23 16.83,43.81 16.83,51.44 | 17.46,43.18 17.41,43.23 | 16.83,51.44 16.83,51.47 | U1.4 65.09,31.11 65.09,33.02 57.47,40.64
  Top 0.305: 71.44,46.35 C2.1
  Bottom 0.152: 9.16,20.95 9.16,33.6 IC2.2 | D6.A 76.52,51.44 C2.1 72.71,46.1 78.96,39.85 78.96,38.79 D8.A 79.11,38.63 79.11,38.18 | TRSC.1 87.95,43.05 89.33,44.44 89.33,49.14 87.95,50.52 TRSB.1 | C1.1 72.71,57.84 78.96,64.08 D4.A | FTDI.2 79.11,69.53 79.11,64.24 D4.A | D4.A 81.09,62.1 87.95,62.1 TRSA.1 | 89.01,22.94 87.95,21.87 LIDAR1.4 87.95,22.23 89.22,22.23 89.22,28.57 88.58,29.21 87.95,29.21 88.01,29.27 | v44.13,48.9 44.13,43.81 C7.1
  Bottom 0.305: 89.01,28.27 88.01,29.27 79.11,38.18
L_DIST  (via drill 0.35)
  Top 0.152: 56.55,56.31 IC1.40
  Top 0.305: v48.48,53.11 51.88,56.52 54.22,56.52 54.47,56.27 56.56,56.27 IC1.40
  Bottom 0.305: v48.48,53.11 48.48,49 57.47,40.01 L_DIST.K
L_RED  (via drill 0.35)
  Top 0.152: 56.55,56.77 IC1.41
  Top 0.305: 56.55,56.77 55.24,56.77 54.61,57.4 51.99,57.4 50.19,55.6 v46.62,55.6
  Bottom 0.305: v46.62,55.6 46.62,47.36 49.85,44.13 L_RED.K
L_TRSA  (via drill 0.35)
  Top 0.152: 56.55,55.7 IC1.39
  Top 0.305: IC1.39 53.6,55.74 v53.56,55.7
  Bottom 0.152: 66.31,13.34 L_TRSA.K
  Bottom 0.305: v53.56,55.7 51.4,57.86 48.62,57.86 47.55,56.79 47.55,47.21 53.59,41.16 53.59,12.45 54.29,11.75 64.72,11.75 66.31,13.34
L_TRSB  (via drill 0.35)
  Top 0.152: 56.71,55.24 IC1.38
  Top 0.305: 56.71,55.24 60.33,55.24 63.83,58.75 68.3,58.75 75.91,51.14 v75.91,36.04
  Bottom 0.152: 79.26,32.69 79.41,32.69 79.72,32.38 | 74.08,13.34 L_TRSB.K
  Bottom 0.305: 79.26,32.69 v75.91,36.04 | 79.72,32.38 79.72,30.86 74.08,25.22 74.08,13.34
L_TRSC  (via drill 0.35)
  Top 0.305: IC1.37 58.88,54.74 v59.31,54.32
  Bottom 0.152: 81.7,13.34 L_TRSC.K
  Bottom 0.305: v59.31,54.32 61.57,54.32 63.07,52.82 79.57,52.82 81.7,50.69 81.7,36.68 89.64,28.74 89.64,21.27 81.7,13.34
N$15
  Top 0.305: 60.24,27.76 63.36,27.76 U1.2
  Top 0.406: R11.1 60.24,27.76 R10.2
N$16
  Top 0.152: 70.8,18.41 R4.1
  Top 0.305: R4.1 71.21,13.34 L_TRSB.A
N$22  (via drill 0.35)
  Top 0.305: v39.22,49.7 39.52,50 39.52,50.05 39.72,50.24 IC1.98
  Bottom 0.305: C6.1 39.05,45.72 39.05,49.53 v39.22,49.7
N$32
  Top 0.152: 39.48,18.36 R1.1
  Top 0.305: 39.48,18.36 39.48,13.49 39.64,13.34 L_5V.A
N$33
  Top 0.152: 47.1,18.36 R2.1
  Top 0.305: 47.1,18.36 47.1,13.49 47.26,13.34 L_RED.A
N$34
  Top 0.152: 63.72,18.36 R3.1
  Top 0.305: 63.72,18.36 63.72,13.34 L_TRSA.A
N$36
  Top 0.152: 78.96,18.36 R5.1 | 78.96,13.34 L_TRSC.A
  Top 0.305: 78.96,13.34 78.96,18.36
N$37
  Top 0.152: 54.72,18.36 R6.1
  Top 0.305: 54.72,18.36 54.72,13.49 54.88,13.34 L_DIST.A
PWRIN
  Top 0.813: D3.A 14.29,5.71 10.72,9.28 J1.1
RESET  (via drill 0.35)
  Top 0.305: IC1.30 54.8,51.24 v53.98,52.07 | v62.55,63.5 62.55,65.18 R8.2 63.82,66.45 C8.2
  Bottom 0.305: v53.98,52.07 53.98,53.02 62.55,61.59 v62.55,63.5
RF-LRW
  Top 0.406: ANTENA.1 8.57,60.96 16.83,69.22 20.64,69.22 21.91,67.94 27.62,67.94 28.26,68.58 LRW-RN2903.23
RST-LRW
  Top 0.406: R9.2 15.33,62.87 LRW-RN2903.32
RX-CP  (via drill 0.35)
  Top 0.305: v47.94,66.04 48.08,65.91 IC1.64
  Bottom 0.305: FTDI.5 70.17,67.94 69.85,67.63 49.53,67.63 v47.94,66.04
RX-LID1  (via drill 0.35)
  Top 0.305: v49.21,57.15 51.31,59.24 IC1.46
  Bottom 0.305: LIDAR1.2 87.27,25.77 66.67,46.35 53.66,46.35 49.21,50.8 v49.21,57.15
RX-LID2
  Top 0.305: LIDAR2.2 84.14,18.14 84.14,21.59 81.6,24.13 75.88,24.13 73.34,26.67 73.34,33.66 61.28,45.72 49.21,45.72 48.58,46.35 IC1.13
RX-LRW
  Top 0.305: LRW-RN2903.7 36.52,51.44 39.38,48.58 43.18,48.58 43.58,48.18 IC1.3
TX-CP  (via drill 0.35)
  Top 0.305: IC1.63 48.58,65.22 v48.76,65.41
  Bottom 0.305: v48.76,65.41 50.35,66.99 71.75,66.99 72.71,67.94 FTDI.4
TX-LID1  (via drill 0.35)
  Top 0.305: IC1.45 52.08,58.74 v50.16,56.83
  Bottom 0.305: v50.16,56.83 50.16,51.12 54.29,46.99 66.9,46.99 86.12,27.77 LIDAR1.1
TX-LID2
  Top 0.305: LIDAR2.1 84.77,19.51 84.77,22.24 82.24,24.77 76.21,24.77 74.12,26.86 74.12,34.16 59.51,48.77 48.45,48.77 48.08,48.4 IC1.12
TX-LRW
  Top 0.305: LRW-RN2903.6 37.15,50.16 41.27,46.04 42.73,46.04 43.08,46.39 IC1.2
VO_A  (via drill 0.35)
  Top 0.152: 79.11,54.03 D4.C | 79.11,59.97 79.11,60.05
  Top 0.305: IC1.55 52.6,63.27 52.6,65.39 52.93,65.72 56.2,65.72 61.23,60.69 v79.06,60.69 79.11,60.69 79.11,60.05 | D5.A 82.77,54.03 79.11,54.03 79.11,59.97
  Bottom 0.406: TRSA.2 87.31,60.69 v79.06,60.69
VO_B  (via drill 0.35)
  Top 0.152: 87.95,48.54 TRSB.2 | 53.05,63.32 IC1.54
  Top 0.305: 87.95,48.54 87.77,48.54 85.04,45.81 v85.04,44.6 | 53.05,63.32 53.05,64.72 53.48,65.15 55.82,65.15 60.98,59.98 68.92,59.98 77.37,51.54 77.37,42.96 D6.C 79.27,41.06 82.65,41.06 D7.A
  Bottom 0.305: v85.04,44.6 85.04,43.66 82.87,41.49 D7.A
VO_C
  Top 0.152: 79.11,28.57 D8.C 78.96,28.57 | 82.77,28.57 D9.A | 78.04,37.11 78.06,37.2
  Top 0.305: IC1.53 53.58,64.37 53.66,64.45 55.22,64.45 60.22,59.46 68.48,59.46 76.52,51.42 76.52,38.73 78.06,37.2 TRSC.2 | 82.77,28.57 79.11,28.57 | 78.96,28.57 76.21,28.57 74.87,29.92 74.87,33.93 78.04,37.11
XTAL1
  Top 0.305: IC1.34 60.55,53.24 Q1.1 66.36,55.24 | 66.36,55.24 66.59,55.24 R7.1 | 66.36,55.24 67.63,56.52 C1.2
XTAL2
  Top 0.305: IC1.33 59.97,52.74 Q1.2 66.36,50.16 | 66.36,50.16 66.59,50.16 R7.2 | 66.36,50.16 67.63,48.9 C2.2